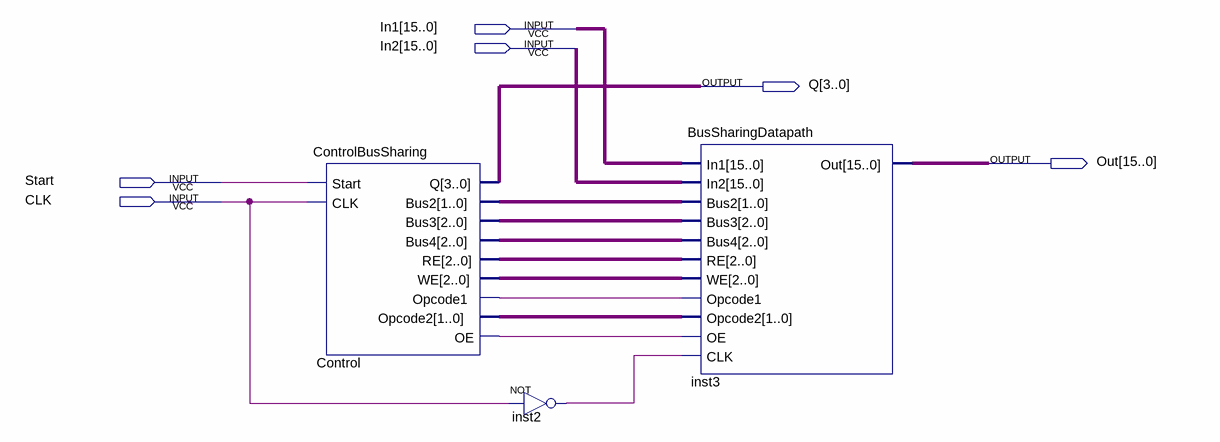
[diagram p0: schematic sheet]
// Quartus schematic BusSharing.bdf as structural Verilog: 3 symbols, 6 pins
module BusSharing (
  input  [15:0] In1,
  input  [15:0] In2,
  input  Start,
  input  CLK,
  output [3:0] Q,
  output [15:0] Out
);

  wire Control_oe, Control_opcode1, inst2_out;
  wire [1:0] Control_bus2, Control_opcode2;
  wire [2:0] Control_bus3, Control_bus4, Control_re, Control_we;

  ControlBusSharing Control (
    .Start(Start), .CLK(CLK), .Q(Q), .Bus2(Control_bus2), .Bus3(Control_bus3), .Bus4(Control_bus4),
    .RE(Control_re), .WE(Control_we), .Opcode1(Control_opcode1), .Opcode2(Control_opcode2), .OE(Control_oe));
  not inst2 (inst2_out, CLK);
  BusSharingDatapath inst3 (
    .In1(In1), .In2(In2), .Bus2(Control_bus2), .Bus3(Control_bus3), .Bus4(Control_bus4), .RE(Control_re),
    .WE(Control_we), .Opcode1(Control_opcode1), .Opcode2(Control_opcode2), .OE(Control_oe), .CLK(inst2_out),
    .Out(Out));
endmodule
